# Altium schematic sheet ProExtBus.SchDoc
size A
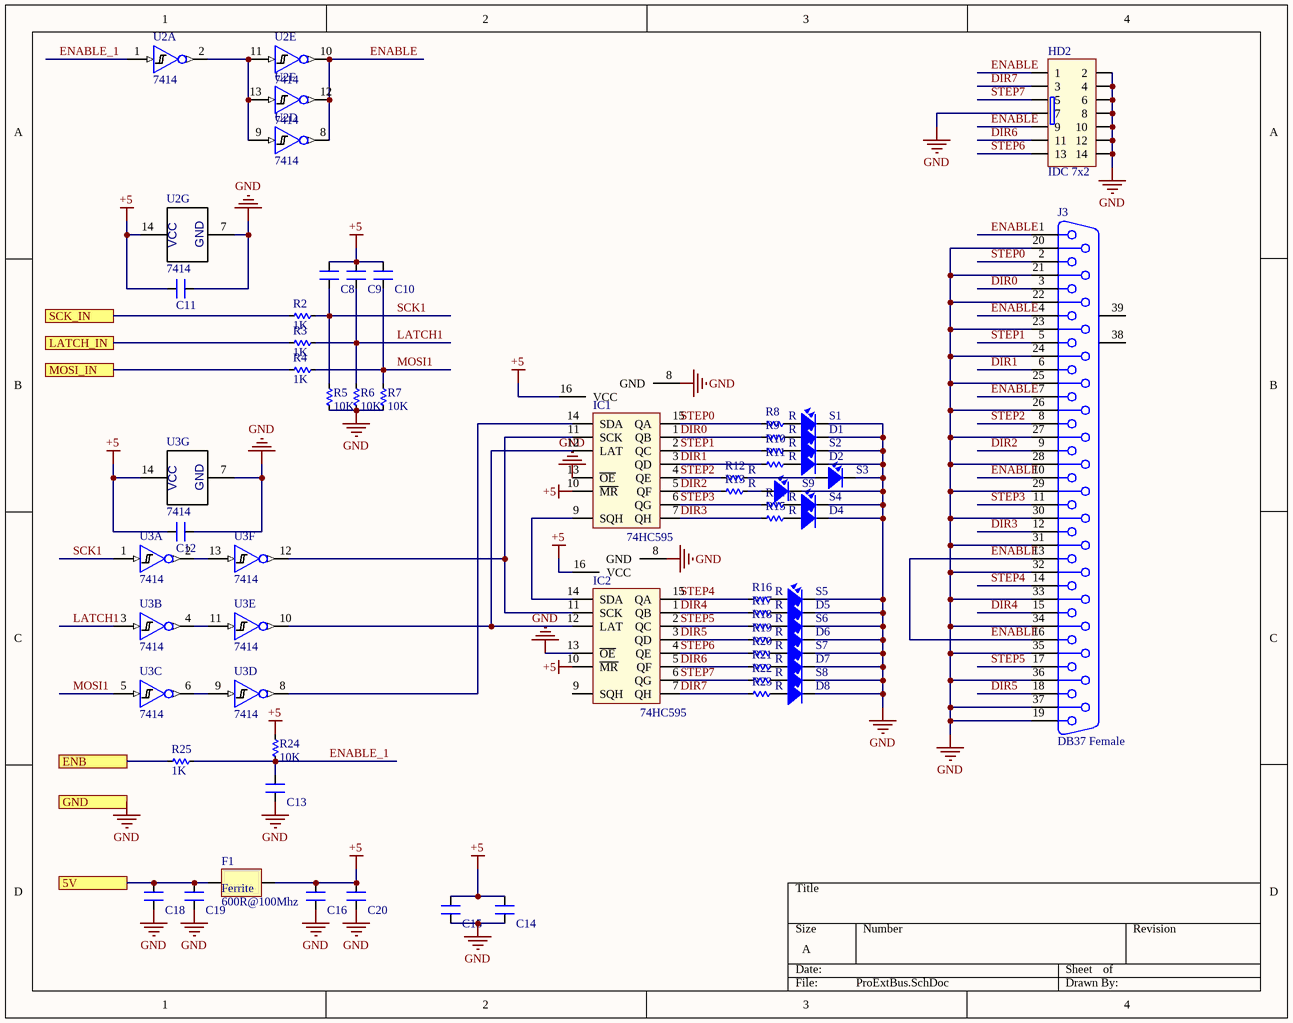
[diagram p0: ProExtBus.SchDoc]

## Parts
C8  CN  [CN-SMD-0603_big]  (value not drawn)
C9  CN  [CN-SMD-0603_big]  (value not drawn)
C10  CN  [CN-SMD-0603_big]  (value not drawn)
C11  CN  [CN-SMD-0603_big]  (value not drawn)
C12  CN  [CN-SMD-0603_big]  (value not drawn)
C13  CN  [CN-SMD-0603_big]  (value not drawn)
C14  CN  [CN-SMD-0603_big]  (value not drawn)
C15  CN  [CN-SMD-0603_big]  (value not drawn)
C16  CN  [CN-SMD-0603_big]  (value not drawn)
C18  CN  [CN-SMD-0603_big]  (value not drawn)
C19  CN  [CN-SMD-0603_big]  (value not drawn)
C20  CN  [CN-SMD-0603_big]  (value not drawn)
D1  LED  [LED-0805-Blue]  (value not drawn)
D2  LED  [LED-0805-Blue]  (value not drawn)
D4  LED  [LED-0805-Blue]  (value not drawn)
D5  LED  [LED-0805-Blue]  (value not drawn)
D6  LED  [LED-0805-Blue]  (value not drawn)
D7  LED  [LED-0805-Blue]  (value not drawn)
D8  LED  [LED-0805-Blue]  (value not drawn)
F1  600R@100Mhz  [Capacitor_805]
HD2  IDC 7x2  [IDC14]
IC1  74HC595  [SO16]
IC2  74HC595  [SO16]
J3  DB37 Female  [DB37]
R2  1K  [RES-SMD-0603_BIG]
R3  1K  [RES-SMD-0603_BIG]
R4  1K  [RES-SMD-0603_BIG]
R5  10K  [RES-SMD-0603_BIG]
R6  10K  [RES-SMD-0603_BIG]
R7  10K  [RES-SMD-0603_BIG]
R8  R  [RES-SMD-0603_BIG]
R9  R  [RES-SMD-0603_BIG]
R10  R  [RES-SMD-0603_BIG]
R11  R  [RES-SMD-0603_BIG]
R12  R  [RES-SMD-0603_BIG]
R13  R  [RES-SMD-0603_BIG]
R14  R  [RES-SMD-0603_BIG]
R15  R  [RES-SMD-0603_BIG]
R16  R  [RES-SMD-0603_BIG]
R17  R  [RES-SMD-0603_BIG]
R18  R  [RES-SMD-0603_BIG]
R19  R  [RES-SMD-0603_BIG]
R20  R  [RES-SMD-0603_BIG]
R21  R  [RES-SMD-0603_BIG]
R22  R  [RES-SMD-0603_BIG]
R23  R  [RES-SMD-0603_BIG]
R24  10K  [RES-SMD-0603_BIG]
R25  1K  [RES-SMD-0603_BIG]
S1  LED  [LED-0805-Blue]  (value not drawn)
S2  LED  [LED-0805-Blue]  (value not drawn)
S3  LED  [LED-0805-Blue]  (value not drawn)
S4  LED  [LED-0805-Blue]  (value not drawn)
S5  LED  [LED-0805-Blue]  (value not drawn)
S6  LED  [LED-0805-Blue]  (value not drawn)
S7  LED  [LED-0805-Blue]  (value not drawn)
S8  LED  [LED-0805-Blue]  (value not drawn)
S9  LED  [LED-0805-Blue]  (value not drawn)
U2  7414  [SO14]  (parts A,D,E,F,G of 7)
U3  7414  [SO14]  (parts A,B,C,D,E,F,G of 7)

## Ports
5V, ENB, GND, LATCH_IN, MOSI_IN, SCK_IN

## Nets
+5: C8.2 C9.2 C10.2 C11.1 C12.1 C14.2 C15.2 C16.2 C20.2 F1.2 IC1.10(~{MR}) IC1.16(VCC) IC2.10(~{MR}) IC2.16(VCC) R24.1 U2.14(VCC) U3.14(VCC)  [also labelled VCC]
GND: C11.2 C12.2 C13.1 C14.1 C15.1 C16.1 C18.1 C19.1 C20.1 D1.2 D2.2 D4.2 D5.2 D6.2 D7.2 D8.2 HD2.2 HD2.4 HD2.6 HD2.7 HD2.8 HD2.10 HD2.12 HD2.14 IC1.8(GND) IC1.13(~{OE}) IC2.8(GND) IC2.13(~{OE}) J3.19 J3.20 J3.21 J3.22 J3.23 J3.24 J3.25 J3.26 J3.27 J3.28 J3.29 J3.30 J3.31 J3.32 J3.33 J3.34 J3.35 J3.36 J3.37 R5.2 R6.2 R7.2 S1.2 S2.2 S3.2 S4.2 S5.2 S6.2 S7.2 S8.2 S9.2 U2.7(GND) U3.7(GND) ; port GND
5V: C18.2 C19.2 F1.1 ; port 5V
DIR0: IC1.1(QB) J3.3 R9.1
DIR1: IC1.3(QD) J3.6 R11.1
DIR2: IC1.5(QF) J3.9 R13.1
DIR3: IC1.7(QH) J3.12 R15.1
DIR4: IC2.1(QB) J3.15 R17.1
DIR5: IC2.3(QD) J3.18 R19.1
DIR6: HD2.11 IC2.5(QF) R21.1
DIR7: HD2.3 IC2.7(QH) R23.1
ENABLE: HD2.1 HD2.9 J3.1 J3.4 J3.7 J3.10 J3.13 J3.16 U2.8(Y) U2.10(Y) U2.12(Y)
ENABLE_1: C13.2 R24.2 R25.1 U2.1(A)
ENB: R25.2 ; port ENB
LATCH1: C9.1 R3.1 R6.1 U3.3(A)
LATCH_IN: R3.2 ; port LATCH_IN
MOSI1: C10.1 R4.1 R7.1 U3.5(A)
MOSI_IN: R4.2 ; port MOSI_IN
SCK1: C8.1 R2.1 R5.1 U3.1(A)
SCK_IN: R2.2 ; port SCK_IN
STEP0: IC1.15(QA) J3.2 R8.1
STEP1: IC1.2(QC) J3.5 R10.1
STEP2: IC1.4(QE) J3.8 R12.1
STEP3: IC1.6(QG) J3.11 R14.1
STEP4: IC2.15(QA) J3.14 R16.1
STEP5: IC2.2(QC) J3.17 R18.1
STEP6: HD2.13 IC2.4(QE) R20.1
STEP7: HD2.5 IC2.6(QG) R22.1
NetD1_1: D1.1 R9.2
NetD2_1: D2.1 R11.2
NetD4_1: D4.1 R15.2
NetD5_1: D5.1 R17.2
NetD6_1: D6.1 R19.2
NetD7_1: D7.1 R21.2
NetD8_1: D8.1 R23.2
NetIC1_9: IC1.9(SQH) IC2.14(SDA)
NetIC1_11: IC1.11(SCK) IC2.11(SCK) U3.12(Y)
NetIC1_12: IC1.12(LAT) IC2.12(LAT) U3.10(Y)
NetIC1_14: IC1.14(SDA) U3.8(Y)
NetR8_2: R8.2 S1.1
NetR10_2: R10.2 S2.1
NetR12_2: R12.2 S3.1
NetR13_2: R13.2 S9.1
NetR14_2: R14.2 S4.1
NetR16_2: R16.2 S5.1
NetR18_2: R18.2 S6.1
NetR20_2: R20.2 S7.1
NetR22_2: R22.2 S8.1
NetU2_2: U2.2(Y) U2.9(A) U2.11(A) U2.13(A)
NetU3_2: U3.2(Y) U3.13(A)
NetU3_4: U3.4(Y) U3.11(A)
NetU3_6: U3.6(Y) U3.9(A)

Not connected (* = marked no-connect by the designer): IC2 9(SQH); J3 38(MH1) 39(MH2)

## Library data of the parts
C8-C16 C18-C20 = CN: Value: 33pF
D1 D2 D4-D8 S1-S9 = LED SMD: Value: LED 3 - 5 ly 2 Colour
F1 = Ferrite
HD2 = IDC 7X2: Value: Header 5x2
IC1 IC2 = 74595: 8 Bit Serial input - Parallel Output; Value: 74HC595
R2-R7 R24 R25 = R
U2 U3 = 7414: IC, M74HC04M, Hex Inverter, SO-14; Text Field1: ST; Text Field2: M74HC04M1R; Text Field3: Mouser; Text Field4: 511-M74HC04M; Text Field6: .22; Text Field5: SO-14; NI?: *; O?: *; Section:: *